# EAGLE design Brakeman (EAGLE 7.7.0)
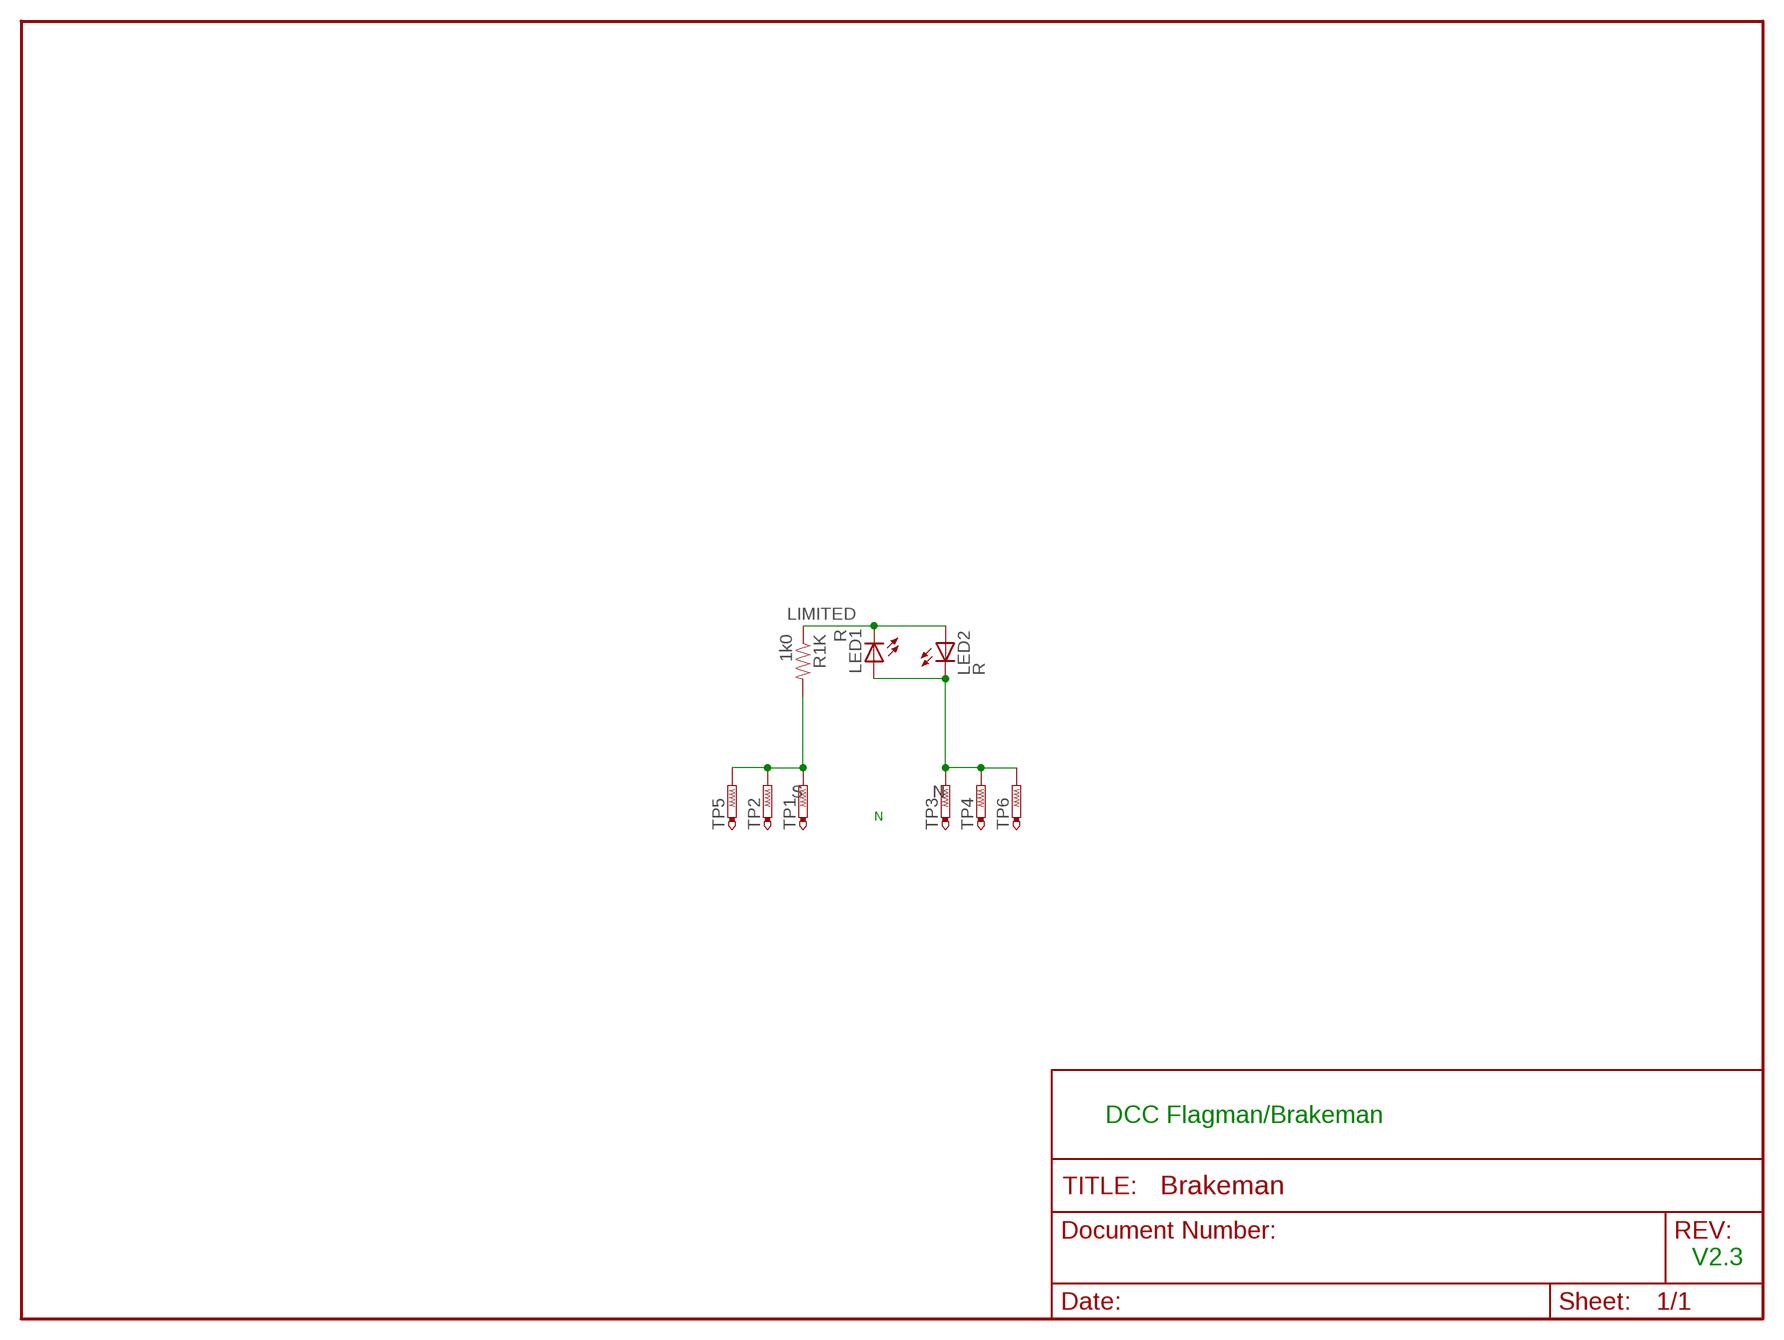
[diagram p0: schematic, sheet 1]

## Parts
LED1  R  LED0603-LED  [0603-LED]
LED2  R  LED0603-LED  [0603-LED]
R1K  1k0  R0603-RES  [0603-RES]
TP1  PTR1PAD1-13  [P1-13]
TP2  PTR1PAD1-13  [P1-13]
TP3  PTR1PAD1-13  [P1-13]
TP4  PTR1PAD1-13  [P1-13]
TP5  PTR1PAD1-13  [P1-13]
TP6  PTR1PAD1-13  [P1-13]

## Nets
LIMITED: LED1.C LED2.A R1K.1
N: LED1.A LED2.C TP3.TP TP4.TP TP6.TP
S: R1K.2 TP1.TP TP2.TP TP5.TP

## Notes on the sheet
- N
- DCC Flagman/Brakeman
- V2.3

## Library data of the parts
LED1 LED2 = SPCoast:LED*
R1K = SPCoast:R*: Resistor Basic schematic elements and footprints for 0603, 1206, and PTH 1/10th watt (small) resistors.
TP1-TP6 = testpad:PTR1: TEST PIN

## Board
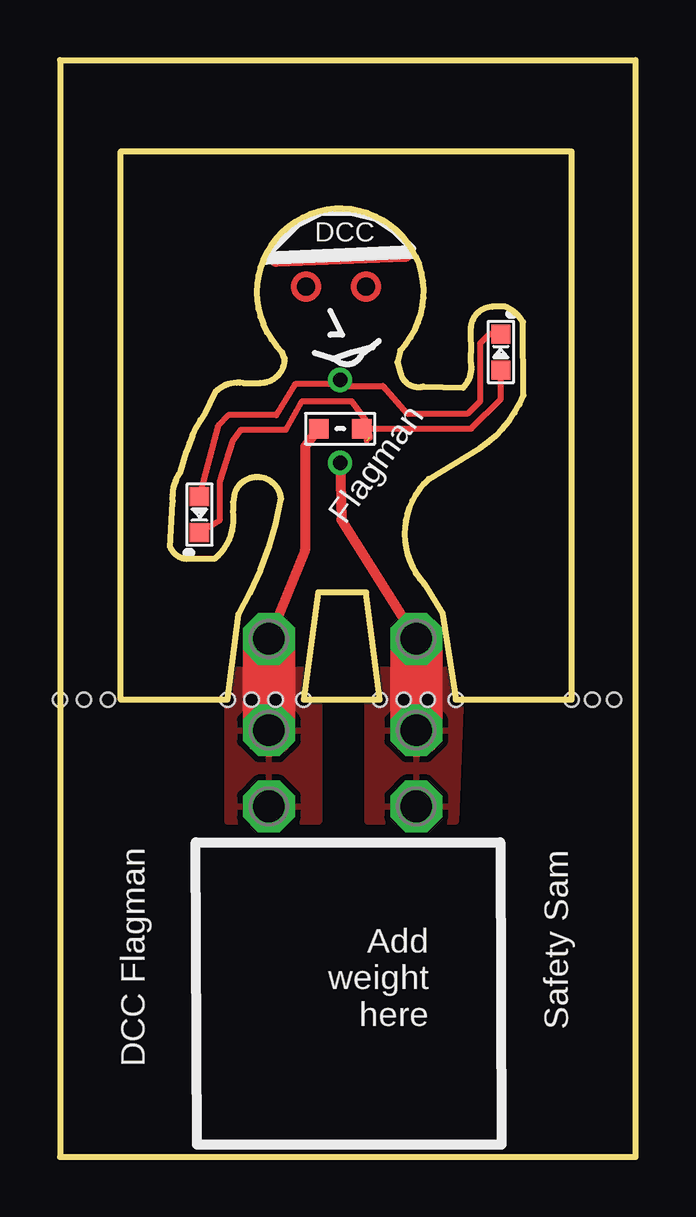
[diagram p1: board, top side]
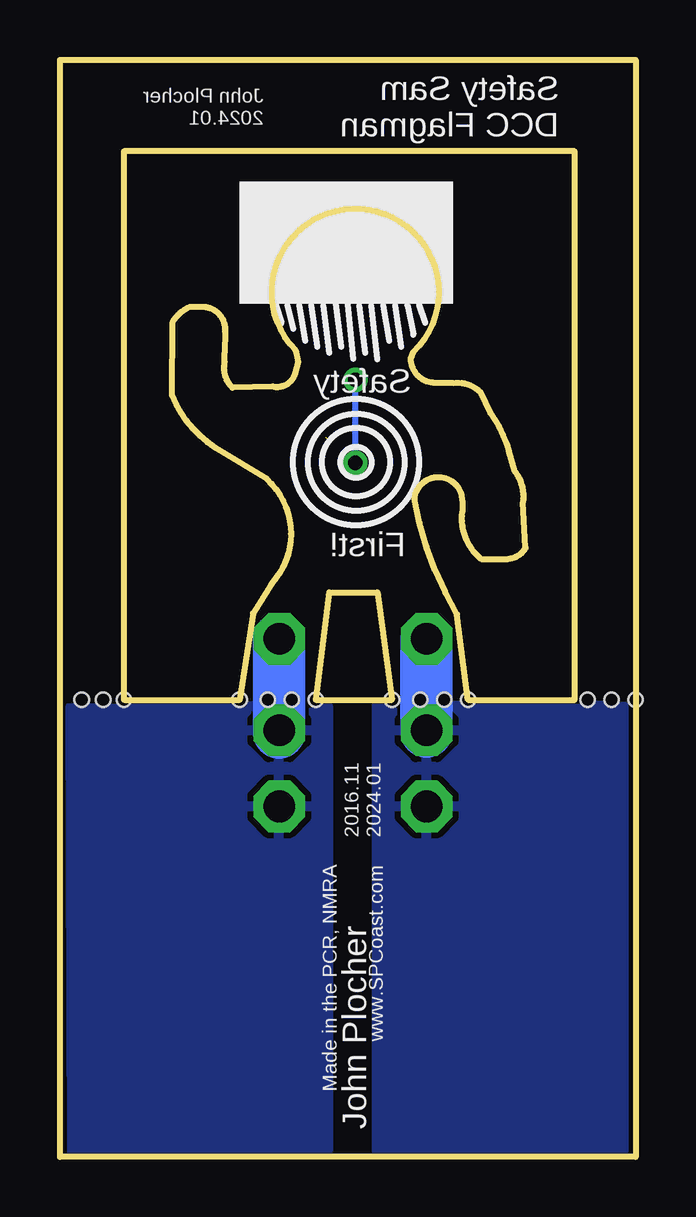
[diagram p2: board, bottom side, seen from below]

Size 24 x 45.72 mm. Coordinates in mm from the lower left corner, seen from the top.
Outline: 14.19,33.62 arc270 9.27,33.54 9.37,33.27 arc-90 8.36,32.26 7.63,32.26 arc53 6.48,31.88 6.06,31.01 arc21 5.29,29.42 5.03,28.56 arc43 4.7,27.3 4.59,25.41 arc63 5.3,24.92 6.45,24.92 arc59 7.21,26.91 7.21,27.28 7.29,27.69 arc-154 9.22,27.43 arc-21 7.44,22.61 6.99,19.05 2.54,19.05 2.54,41.91 21.34,41.91 21.34,19.05 16.51,19.05 15.95,22.66 15.19,23.88 arc-90 15.38,28.25 17.52,29.55 arc35 19.33,31.75 19.3,34.8 arc37 18.58,35.43 18.01,35.43 arc90 17.12,34.41 17.14,33.53 17.13,33.14 arc-59 16.81,32.06 15.14,32.11 arc-90 14.2,32.66 14.07,33.12 14.19,33.62
Outline: 13.34,19.05 12.77,23.53 10.77,23.53 10.16,19.05 13.34,19.05
Outline: 0,45.72 24,45.72 24,0 0,0 0,45.72
Copper layers (1*16): Top 0.035mm / dielectric 1.5mm / Bottom 0.035mm
Design rules "default": minimum track width 10mil, minimum drill 0.6mm, track to track 8mil, track to pad 8mil, pad to pad 8mil, via to via 8mil, smd to smd 8mil, copper to edge 1mil, drill to drill 8mil, minimum pad ring 10mil, minimum via ring 8mil, stop-mask expansion 4mil, vias tented up to drill 0mil, thermal gap 10mil
Holes 0.6 mm at 6.99,19.05 10.16,19.05 13.34,19.05 16.51,19.05 0,19.05 21.34,19.05 1,19.05 2,19.05 7.99,19.05 8.98,19.05 14.34,19.05 15.34,19.05 22.2,19.05 23.1,19.05

### Footprints (pad centres in the part's own frame; a part is rotated, then mirrored left to right if it is on the bottom)
0603-LED = smd 0.8 x 0.8: A 0.75,0; C -0.75,0
0603-RES = smd 0.813 x 0.813: 1 -0.9,0; 2 0.9,0
P1-13 = drill 1.321 pad 2.159 octagon: TP 0,0

### Placement (x,y rotation side)
LED1  5.82,26.77 90 top
LED2  18.39,33.55 270 top
R1K  11.68,30.35 180 top
TP1  8.71,17.78 90 top
TP2  8.71,14.61 0 top
TP3  14.86,17.78 0 top
TP4  14.86,14.61 0 top
TP5  8.71,21.59 0 top
TP6  14.86,21.59 0 top

### Tracks (layer width: path | path; a pad name or v marks a point on that pad's centre or on a via)
LIMITED  (1 unrouted)
  Top 0.254: 12.91,29.97 arc90 R1K.1 17.14,30.35 18.39,31.59 LED2.A | 12.8,29.86 12.8,30.63 12.17,31.5 10.1,31.5 9.42,30.31 7.55,30.31 7.22,29.86 6.67,28.15 6.67,26.55 LED1.C
N  (via drill 0.6 pad 1.01)
  Top 0.254: LED1.A 6.62,30.51 7.02,30.91 9.02,30.91 9.8,32.2 11.49,32.2 v11.68,32.38 11.94,32.13 13.46,32.13 14.48,30.99 17.02,30.99 17.53,31.5 17.53,33.91 17.91,34.3 LED2.C
  Top 0.406: TP6.TP 11.73,26.54 v11.68,28.93
  Top 2.184: TP6.TP TP3.TP
  Bottom 0.254: v11.68,28.93 v11.68,32.38
  Bottom 2.184: TP6.TP 14.86,17.68
  pour Top: 12.83,20.32 16.76,20.32 16.51,13.97 12.83,13.97
  pour Bottom: 12.83,18.8 12.83,0.25 23.5,0.25 23.55,18.8
S
  Top 0.406: TP5.TP 10.21,25.27 10.22,29.61 R1K.2
  Top 2.184: TP5.TP TP1.TP
  Bottom 2.184: TP5.TP 8.71,17.73
  pour Top: 6.99,20.32 10.79,20.32 10.79,13.97 6.99,13.97
  pour Bottom: 0.5,18.8 10.79,18.8 10.79,0.25 0.5,0.25
S$1
  Top 0.61: 9,37.4 14.4,37.6
(copper drawn outside any net)
  shapes: Top circle x2

### Text on the board
tPlace: DCC | Flagman | DCC Flagman | Add / weight / here | Safety Sam
bPlace: Safety Sam / DCC Flagman | John Plocher / 2024.01 | Safety | First! | 2016.11 / 2024.01 | www.SPCoast.com | Made in the PCR, NMRA | John Plocher